# EasyEDA Pro project miniMQ.epro, schematic ArtNet-Pico-ISO
Board Name: ArtNet-Pico-ISO; Create Date: 2026-09-10; Page Name: P1; Project Name: MagicQ Compact Mini Connect; Schematic Name: ArtNet-Pico-ISO; Update Date: 2026-09-18; Company: EasyEDA.com; Page Size: A4; Version: V1.0
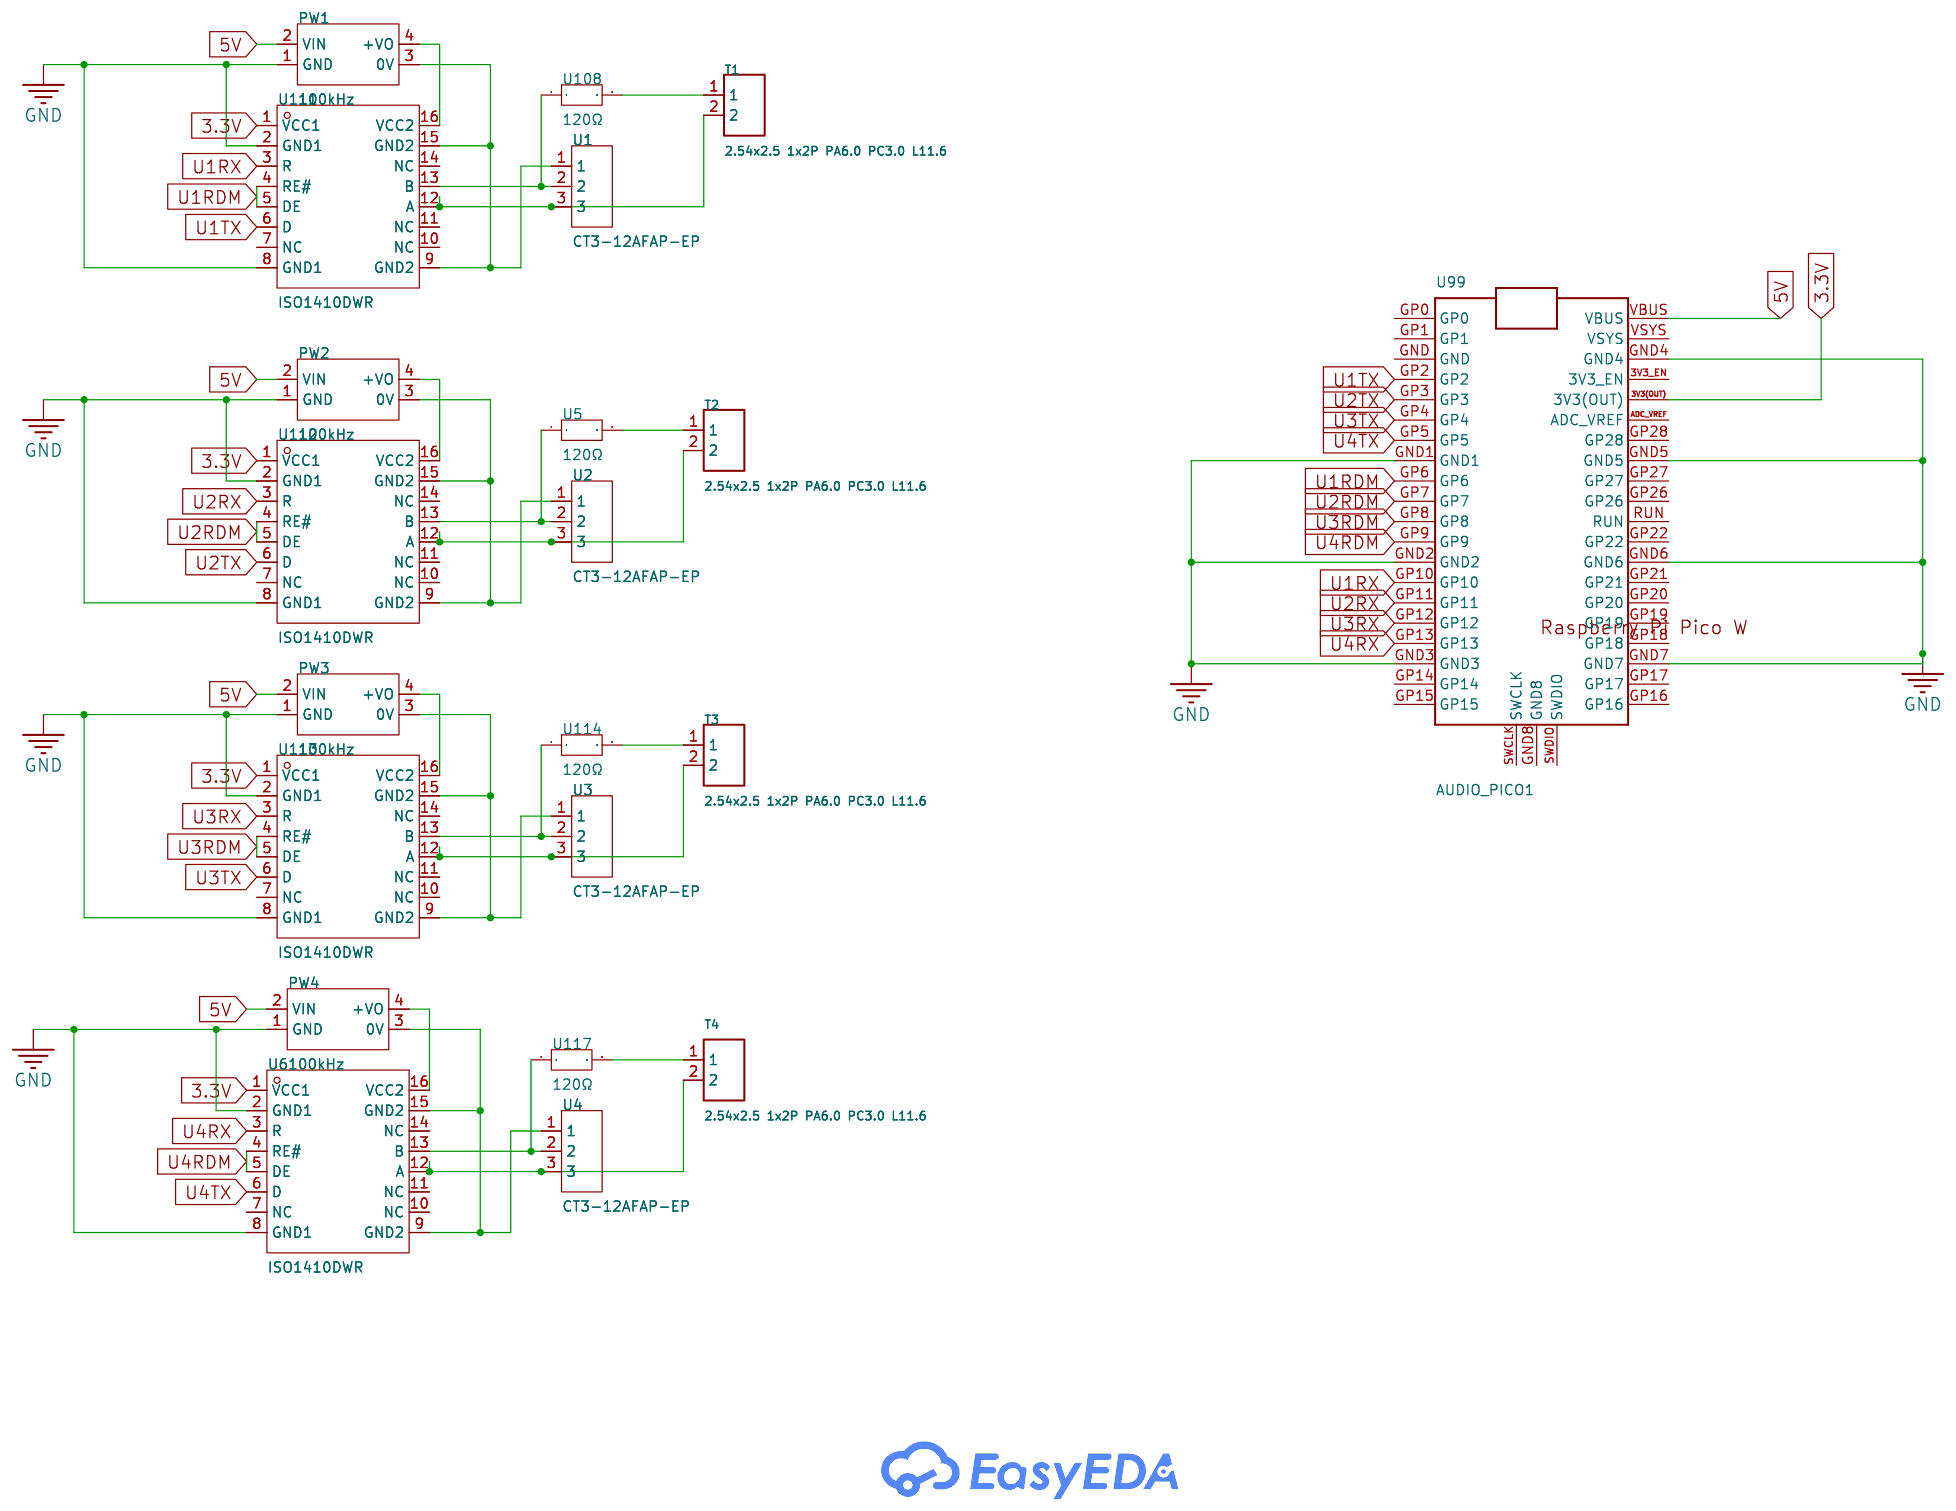
[diagram p3: schematic sheet]

## Parts
PW1  100kHz  [PWRM-TH_B0505S-1W]
PW2  100kHz  [PWRM-TH_B0505S-1W]
PW3  100kHz  [PWRM-TH_B0505S-1W]
PW4  100kHz  [PWRM-TH_B0505S-1W]
T1  2.54x2.5 1x2P PA6.0 PC3.0 L11.6  [HDR-TH_2P-P2.54-V-M-R2-C1-S2.54_3]
T2  2.54x2.5 1x2P PA6.0 PC3.0 L11.6  [HDR-TH_2P-P2.54-V-M-R2-C1-S2.54_3]
T3  2.54x2.5 1x2P PA6.0 PC3.0 L11.6  [HDR-TH_2P-P2.54-V-M-R2-C1-S2.54_3]
T4  2.54x2.5 1x2P PA6.0 PC3.0 L11.6  [HDR-TH_2P-P2.54-V-M-R2-C1-S2.54_3]
U1  CT3-12AFAP-EP  [CONN-TH_CT3-12AFAP-EP]
U2  CT3-12AFAP-EP  [CONN-TH_CT3-12AFAP-EP]
U3  CT3-12AFAP-EP  [CONN-TH_CT3-12AFAP-EP]
U4  CT3-12AFAP-EP  [CONN-TH_CT3-12AFAP-EP]
U5  120Ω  [RES-TH_BD2.4-L6.3-P10.30-D0.6]
U6  ISO1410DWR  [SOIC-16_L10.3-W7.5-P1.27-LS10.3-BL]
U99  AUDIO_PICO1  [RASPBERRYPIPICO]
U108  120Ω  [RES-TH_BD2.4-L6.3-P10.30-D0.6]
U111  ISO1410DWR  [SOIC-16_L10.3-W7.5-P1.27-LS10.3-BL]
U112  ISO1410DWR  [SOIC-16_L10.3-W7.5-P1.27-LS10.3-BL]
U113  ISO1410DWR  [SOIC-16_L10.3-W7.5-P1.27-LS10.3-BL]
U114  120Ω  [RES-TH_BD2.4-L6.3-P10.30-D0.6]
U117  120Ω  [RES-TH_BD2.4-L6.3-P10.30-D0.6]

## Library data of the parts
PW1-PW4 = B0505S-1W_C20617263: Number of Channels:1 Output Power:1W Voltage - Supply:5V Voltage - Supply:5V Conversion Efficiency:78% Conversion Efficiency:78% Output Voltage:5V Output Voltage:5V Output Current(Max):200mA Output Current(Max):200mA Capacitive Load(Max):220uF Isolation V; LCSC Part Name: 1W定电压输入隔离非稳压输出电源模块; Supplier Part: C20617263; Manufacturer: ReSine PS(瑞鑫); Manufacturer Part: B0505S-1W; Supplier Footprint: SIP,11.6x6mm; JLCPCB Part Class: Extended Part; Datasheet: https://item.szlcsc.com/datasheet/B0505S-1W/21989091.html; Supplier: LCSC; Number of Channels: 1; Output Power: 1W; Voltage - Supply: 5V; Conversion Efficiency: 78%; Output Voltage: 5V; Output Current(Max): 200mA; Capacitive Load(Max): 220uF; Isolation Voltage(Vrms): 1.5kV; Operating Temperature: -40℃~+105℃
T1-T4 = 2.54x2.5 1x2P PA6.0 PC3.0 L11.6: Pin Structure:1x2P Pitch:2.54mm Circluar Pins/Square Pins:Square pin Mounting Type:Through Hole Number of Rows:1 Number of Pins:2P Current Rating:3A Voltage Rating (Max):500V Contact Material:Brass Contact Plating:Gold Operating Temperature:-40℃~+105℃ Ope; LCSC Part Name: 1x2P 间距:2.54mm 方针 直插; Supplier Part: C55829673; Manufacturer: JMEconn(文章济美); Supplier Footprint: 插件,P=2.54mm; JLCPCB Part Class: Extended Part; Datasheet: https://item.szlcsc.com/datasheet/2.54x2.5%25201x2P%2520PA6.0%2520PC3.0%2520L11.6/59981474.html; Supplier: LCSC; Pin Structure: 1x2P; Pitch: 2.54mm; Circluar Pins/Square Pins: Square pin; Mounting Type: Through Hole; Number of Rows: 1; Number of Pins: 2P; Current Rating: 3A; Voltage Rating (Max): 500V; Contact Material: Brass; Contact Plating: Gold; Operating Temperature: -40℃~+105℃; Color: Black
U1-U4 = CT3-12AFAP-EP: Number of Pins:3P Gender:Female Mounting Type:Right Angle Current Rating:6A Voltage Rating:50V Operating Temperature:-30℃~+80℃ Operating Temperature:-30℃~+80℃; LCSC Part Name: 3Pin 卧式母座 镀金 金属面板 带推柄 螺丝孔接地; Supplier Part: C46594089; Manufacturer: 春生电子; Supplier Footprint: 插件; Datasheet: https://item.szlcsc.com/datasheet/CT3-12AFAP-EP/48729775.html; Supplier: LCSC; Number of Pins: 3P; Gender: Female; Mounting Type: Right Angle; Current Rating: 6A; Voltage Rating: 50V; Operating Temperature: -30℃~+80℃
U5 U108 U114 U117 = MFR-25FTF52-120R: Type:Metal Film Resistor Resistance:120Ω Tolerance:±1% Tolerance:±1% Power(Watts):250mW Temperature Coefficient:±100ppm/℃ Temperature Coefficient:±100ppm/℃ Operating Temperature:-55℃~+155℃ Operating Temperature:-55℃~+155℃; LCSC Part Name: 金属膜电阻 120Ω ±1% 250mW; Supplier Part: C1371058; Manufacturer: YAGEO(国巨); Supplier Footprint: 插件,D2.4xL6.3mm; JLCPCB Part Class: Extended Part; Datasheet: https://item.szlcsc.com/datasheet/MFR-25FTF52-120R/1461347.html; Supplier: LCSC; Type: Metal Film Resistor; Tolerance: ±1%; Power(Watts): 250mW; Temperature Coefficient: ±100ppm/℃; Operating Temperature: -55℃~+155℃
U6 U111-U113 = ISO1410DWR: Data Rate(Max):500Kbps Features:Failure protection circuit；Single-side powered isolation Operating Temperature:-40℃~+125℃ Operating Temperature:-40℃~+125℃; LCSC Part Name: 适用于TIA/EIARS-485和RS-422应用的电隔离差分线路收发器; Supplier Part: C2671566; Manufacturer: TI(德州仪器); Supplier Footprint: SOIC-16-300mil; JLCPCB Part Class: Extended Part; Datasheet: https://www.ti.com/cn/lit/gpn/iso1410; Supplier: LCSC; Data Rate(Max): 500Kbps; Features: Failure protection circuit；Single-side powered isolation; Operating Temperature: -40℃~+125℃
U99 = AUDIO_PICO1: Manufacturer Part: RASPBERRY PI PICO; Supplier: Element14; Supplier Part: 3643332; Manufacturer: Raspberry-PI; link: https://se.farnell.com/b/raspberry-pi

## Nets
3.3V: U6.1(VCC1) U99.3V3(OUT) U111.1(VCC1) U112.1(VCC1) U113.1(VCC1)
5V: PW1.2(VIN) PW2.2(VIN) PW3.2(VIN) PW4.2(VIN) U99.VBUS
GND: PW1.1(GND) PW2.1(GND) PW3.1(GND) PW4.1(GND) U6.2(GND1) U6.8(GND1) U99.GND1 U99.GND2 U99.GND3 U99.GND4 U99.GND5 U99.GND6 U99.GND7 U111.2(GND1) U111.8(GND1) U112.2(GND1) U112.8(GND1) U113.2(GND1) U113.8(GND1)
U1RDM: U99.GP6 U111.4(RE#) U111.5(DE)
U1RX: U99.GP10 U111.3(R)
U1TX: U99.GP2 U111.6(D)
U2RDM: U99.GP7 U112.4(RE#) U112.5(DE)
U2RX: U99.GP11 U112.3(R)
U2TX: U99.GP3 U112.6(D)
U3RDM: U99.GP8 U113.4(RE#) U113.5(DE)
U3RX: U99.GP12 U113.3(R)
U3TX: U99.GP4 U113.6(D)
U4RDM: U6.4(RE#) U6.5(DE) U99.GP9
U4RX: U6.3(R) U99.GP13
U4TX: U6.6(D) U99.GP5
$1N2535: PW1.4(+VO) U111.16(VCC2)
$1N2541: PW1.3(0V) U1.1 U111.9(GND2) U111.15(GND2)
$1N2696: U1.2 U108.1 U111.13(B)
$1N2701: T1.2 U1.3 U111.12(A)
$1N3238: U2.2 U5.1 U112.13(B)
$1N3243: T2.2 U2.3 U112.12(A)
$1N3607: U3.2 U113.13(B) U114.1
$1N3612: T3.2 U3.3 U113.12(A)
$1N3976: U4.2 U6.13(B) U117.1
$1N3981: T4.2 U4.3 U6.12(A)
$1N4867: PW2.4(+VO) U112.16(VCC2)
$1N4880: PW2.3(0V) U2.1 U112.9(GND2) U112.15(GND2)
$1N4888: PW3.4(+VO) U113.16(VCC2)
$1N4901: PW3.3(0V) U3.1 U113.9(GND2) U113.15(GND2)
$1N4914: PW4.3(0V) U4.1 U6.9(GND2) U6.15(GND2)
$1N4922: PW4.4(+VO) U6.16(VCC2)
$1N5139: T1.1 U108.2
$1N5154: T2.1 U5.2
$1N5181: T3.1 U114.2
$1N5186: T4.1 U117.2

Not connected (* = marked no-connect by the designer): U6 7(NC) 10(NC) 11(NC) 14(NC); U99 3V3_EN ADC_VREF GND GND8 GP0 GP1 GP14 GP15 GP16 GP17 GP18 GP19 GP20 GP21 GP22 GP26 GP27 GP28 RUN SWCLK SWDIO VSYS; U111 7(NC) 10(NC) 11(NC) 14(NC); U112 7(NC) 10(NC) 11(NC) 14(NC); U113 7(NC) 10(NC) 11(NC) 14(NC)
